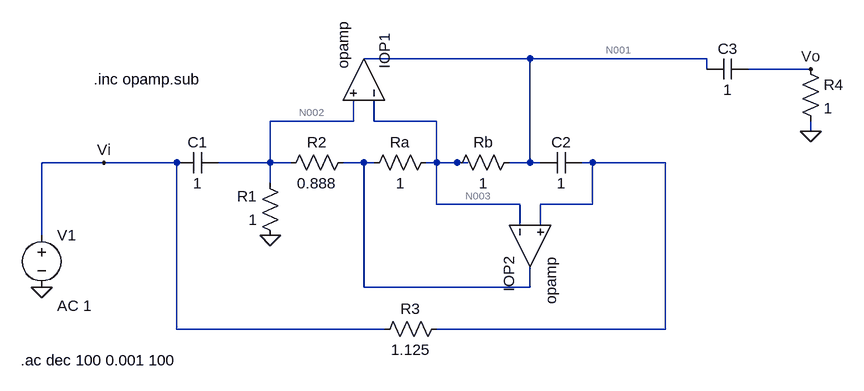
[diagram p0: schematic finalnorm.asc]
finalnorm.asc, the LTspice schematic file:
Version 4
SHEET 1 1052 680
WIRE 544 -32 288 -32
WIRE 816 -32 544 -32
WIRE 816 -16 816 -32
WIRE 976 -16 880 -16
WIRE 272 64 272 32
WIRE 272 64 144 64
WIRE 304 64 304 32
WIRE 400 64 304 64
WIRE 976 80 976 64
WIRE -112 128 -208 128
WIRE 0 128 -112 128
WIRE 144 128 144 64
WIRE 144 128 64 128
WIRE 176 128 144 128
WIRE 288 128 256 128
WIRE 304 128 288 128
WIRE 400 128 400 64
WIRE 400 128 384 128
WIRE 432 128 400 128
WIRE 448 128 432 128
WIRE 544 128 544 -32
WIRE 544 128 512 128
WIRE 560 128 544 128
WIRE 640 128 624 128
WIRE 752 128 640 128
WIRE 144 160 144 128
WIRE 400 192 400 128
WIRE 528 192 400 192
WIRE 640 192 640 128
WIRE 640 192 560 192
WIRE 528 224 528 192
WIRE 560 224 560 192
WIRE -208 240 -208 128
WIRE 288 320 288 128
WIRE 544 320 544 288
WIRE 544 320 288 320
WIRE 0 384 0 128
WIRE 320 384 0 384
WIRE 752 384 752 128
WIRE 752 384 400 384
FLAG 144 240 0
FLAG 976 -16 Vo
FLAG -112 128 Vi
FLAG -208 320 0
FLAG 976 80 0
SYMBOL cap 64 112 R90
WINDOW 0 0 32 VBottom 2
WINDOW 3 32 32 VTop 2
SYMATTR InstName C1
SYMATTR Value 1
SYMBOL res 160 256 R180
WINDOW 0 36 76 Left 2
WINDOW 3 36 40 Left 2
SYMATTR InstName R1
SYMATTR Value 1
SYMBOL res 272 112 R90
WINDOW 0 0 56 VBottom 2
WINDOW 3 32 56 VTop 2
SYMATTR InstName R2
SYMATTR Value 0.888
SYMBOL res 400 112 R90
WINDOW 0 0 56 VBottom 2
WINDOW 3 32 56 VTop 2
SYMATTR InstName Ra
SYMATTR Value 1
SYMBOL res 528 112 R90
WINDOW 0 0 56 VBottom 2
WINDOW 3 32 56 VTop 2
SYMATTR InstName Rb
SYMATTR Value 1
SYMBOL cap 624 112 R90
WINDOW 0 0 32 VBottom 2
WINDOW 3 32 32 VTop 2
SYMATTR InstName C2
SYMATTR Value 1
SYMBOL OpAmps\\opamp 352 0 M270
SYMATTR InstName IOP1
SYMBOL OpAmps\\opamp 480 256 M90
SYMATTR InstName IOP2
SYMBOL res 416 368 R90
WINDOW 0 0 56 VBottom 2
WINDOW 3 32 56 VTop 2
SYMATTR InstName R3
SYMATTR Value 1.125
SYMBOL voltage -208 224 R0
WINDOW 123 24 124 Left 2
WINDOW 39 0 0 Left 0
SYMATTR Value2 AC 1
SYMATTR InstName V1
SYMATTR Value ""
SYMBOL cap 880 -32 R90
WINDOW 0 0 32 VBottom 2
WINDOW 3 32 32 VTop 2
SYMATTR InstName C3
SYMATTR Value 1
SYMBOL res 960 -32 R0
SYMATTR InstName R4
SYMATTR Value 1
TEXT -240 432 Left 2 !.ac dec 100 0.001 100
TEXT -128 0 Left 2 !.inc opamp.sub

The netlist it stands for:
* finalnorm.asc
C1 N002 Vi 1
R1 0 N002 1
R2 N004 N002 0.888
Ra N003 N004 1
Rb N001 N003 1
C2 N005 N001 1
XIOP1 N003 N002 N001 opamp Aol=100K GBW=10Meg  ; pins invin noninvin out
XIOP2 N003 N005 N004 opamp Aol=100K GBW=10Meg  ; pins invin noninvin out
R3 N005 Vi 1.125
V1 Vi 0 AC 1
C3 Vo N001 1
R4 Vo 0 1
.ac dec 100 0.001 100
.inc opamp.sub
.backanno
.end

* Results of the author's LTspice run, read from the files saved beside the schematic
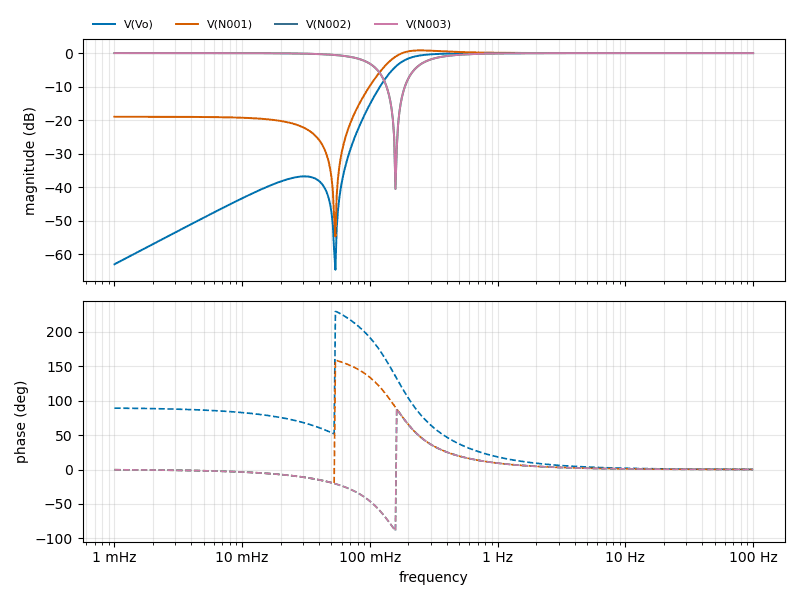
[diagram p1: AC Analysis of finalnorm.asc, plotted from the saved traces]
* AC Analysis, 1 run:
*   V(Vo): -63.05 dB at 1 mHz, -0.00 dB at 100 Hz, peak -0.00 dB at 100 Hz, 3 dB below the peak at 171.8 mHz
*   V(N001): -19.02 dB at 1 mHz, -0.00 dB at 100 Hz, peak 0.80 dB at 245.5 mHz, 3 dB below the peak at 145.1 mHz
*   V(N002): -0.00 dB at 1 mHz, -0.00 dB at 100 Hz, peak -0.00 dB at 100 Hz, 3 dB below the peak at 257.6 mHz
*   V(N003): -0.00 dB at 1 mHz, -0.00 dB at 100 Hz, peak -0.00 dB at 100 Hz, 3 dB below the peak at 257.6 mHz